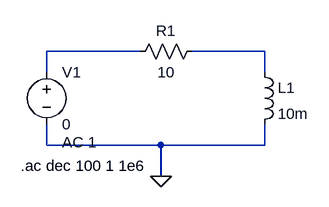
[diagram p0: schematic RL Series.asc]
RL Series.asc, the LTspice schematic file:
Version 4.1
SHEET 1 880 680
WIRE 144 80 0 80
WIRE 336 80 224 80
WIRE 0 112 0 80
WIRE 336 112 336 80
WIRE 0 224 0 192
WIRE 176 224 0 224
WIRE 336 224 336 192
WIRE 336 224 176 224
WIRE 176 272 176 224
FLAG 176 272 0
SYMBOL voltage 0 96 R0
WINDOW 123 24 124 Left 2
WINDOW 39 0 0 Left 0
SYMATTR InstName V1
SYMATTR Value 0
SYMATTR Value2 AC 1
SYMBOL res 240 64 R90
WINDOW 0 0 56 VBottom 2
WINDOW 3 32 56 VTop 2
SYMATTR InstName R1
SYMATTR Value 10
SYMBOL ind 320 96 R0
SYMATTR InstName L1
SYMATTR Value 10m
TEXT -40 256 Left 2 !.ac dec 100 1 1e6

The netlist it stands for:
* RL Series.asc
V1 N001 0 0 AC 1
R1 N002 N001 10
L1 N002 0 10m
.ac dec 100 1 1e6
.backanno
.end